# Altium schematic sheet Relay schematic.SchDoc
size A4; Date: 24/10; Author: Rami Abdelmotalib; DocumentName: Relay circuit
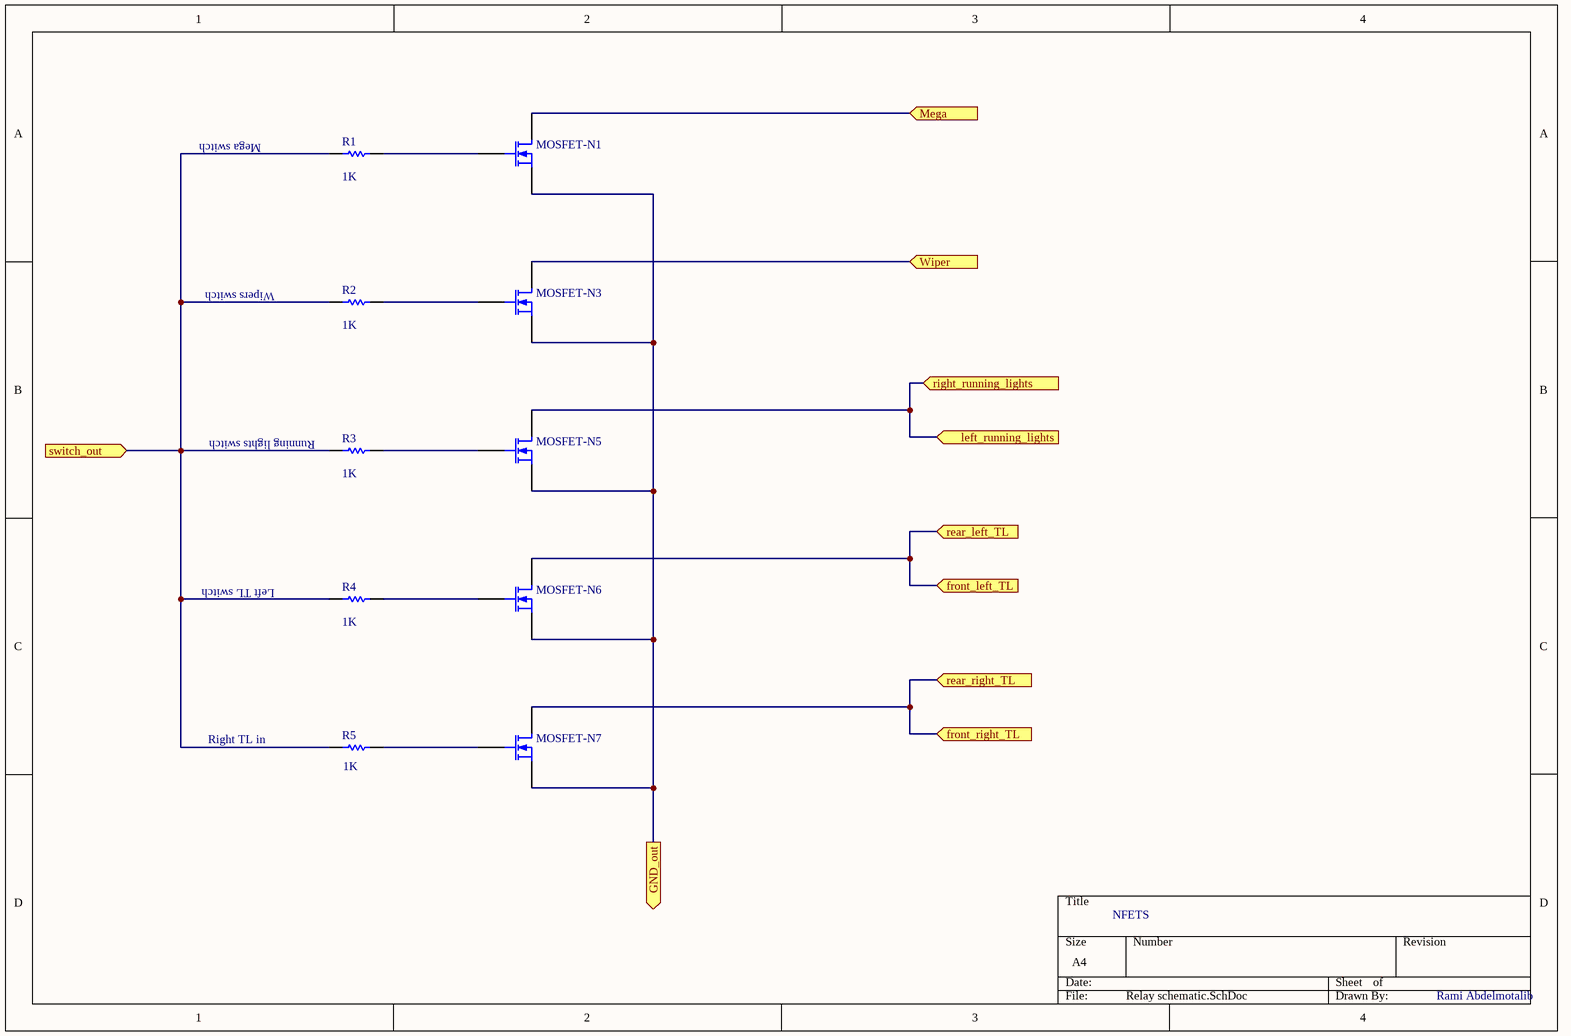
[diagram p0: Relay schematic.SchDoc]

## Parts
MOSFET-N1  (no value)  [E3]
MOSFET-N3  (no value)  [E3]
MOSFET-N5  (no value)  [E3]
MOSFET-N6  (no value)  [E3]
MOSFET-N7  (no value)  [E3]
R1  value 1K  [AXIAL-0.3]
R2  value 1K  [AXIAL-0.3]  (hidden comment: Res1)
R3  value 1K  [AXIAL-0.3]  (hidden comment: Res1)
R4  value 1K  [AXIAL-0.3]  (hidden comment: Res1)
R5  value 1K  [AXIAL-0.3]  (hidden comment: Res1)

## Ports
front_left_TL (in), front_right_TL (in), GND_out (out), left_running_lights (in), Mega (in), rear_left_TL (in), rear_right_TL (in), right_running_lights (in), switch_out (in), Wiper (in)

## Nets
front_left_TL: MOSFET-N6.1(D) ; port front_left_TL, port rear_left_TL
front_right_TL: MOSFET-N7.1(D) ; port front_right_TL, port rear_right_TL
GND_out: MOSFET-N1.3(S) MOSFET-N3.3(S) MOSFET-N5.3(S) MOSFET-N6.3(S) MOSFET-N7.3(S) ; port GND_out
left_running_lights: MOSFET-N5.1(D) ; port left_running_lights, port right_running_lights
Mega: MOSFET-N1.1(D) ; port Mega
Wiper: MOSFET-N3.1(D) ; port Wiper
NetMOSFET-N1_2: MOSFET-N1.2(G) R1.2
NetMOSFET-N3_2: MOSFET-N3.2(G) R2.2
NetMOSFET-N5_2: MOSFET-N5.2(G) R3.2
NetMOSFET-N6_2: MOSFET-N6.2(G) R4.2
NetMOSFET-N7_2: MOSFET-N7.2(G) R5.2
NetR1_1: R1.1 R2.1 R3.1 R4.1 R5.1

## Notes on the sheet
- Mega switch
- Wipers switch
- (near R3) Running lights switch
- Left TL switch
- Right TL in
- NFETS
- Rami Abdelmotalib

## Library data of the parts
MOSFET-N1 MOSFET-N3 MOSFET-N5-MOSFET-N7 = MOSFET-N: N-Channel MOSFET; Published: 8-Jun-2000; LatestRevisionDate: 17-Jul-2002; LatestRevisionNote: Re-released for DXP Platform.; PackageVersion: 1995/1996; PackageReference: E3; Publisher: Altium Limited; PackageDescription: TO, Flat Index; 3 In-Line, Axial Leads; Body Dia. 4.6mm; Lead Dia. 0.5 mm (max)
R1-R5 = Res1: Resistor; Published: 8-Jun-2000; LatestRevisionDate: 17-Jul-2002; LatestRevisionNote: Re-released for DXP Platform.; PackageReference: AXIAL-0.3; Publisher: Altium Limited; PackageDescription: Axial Device, Thru-Hole; 2 Leads; 0.3 in Pin Spacing